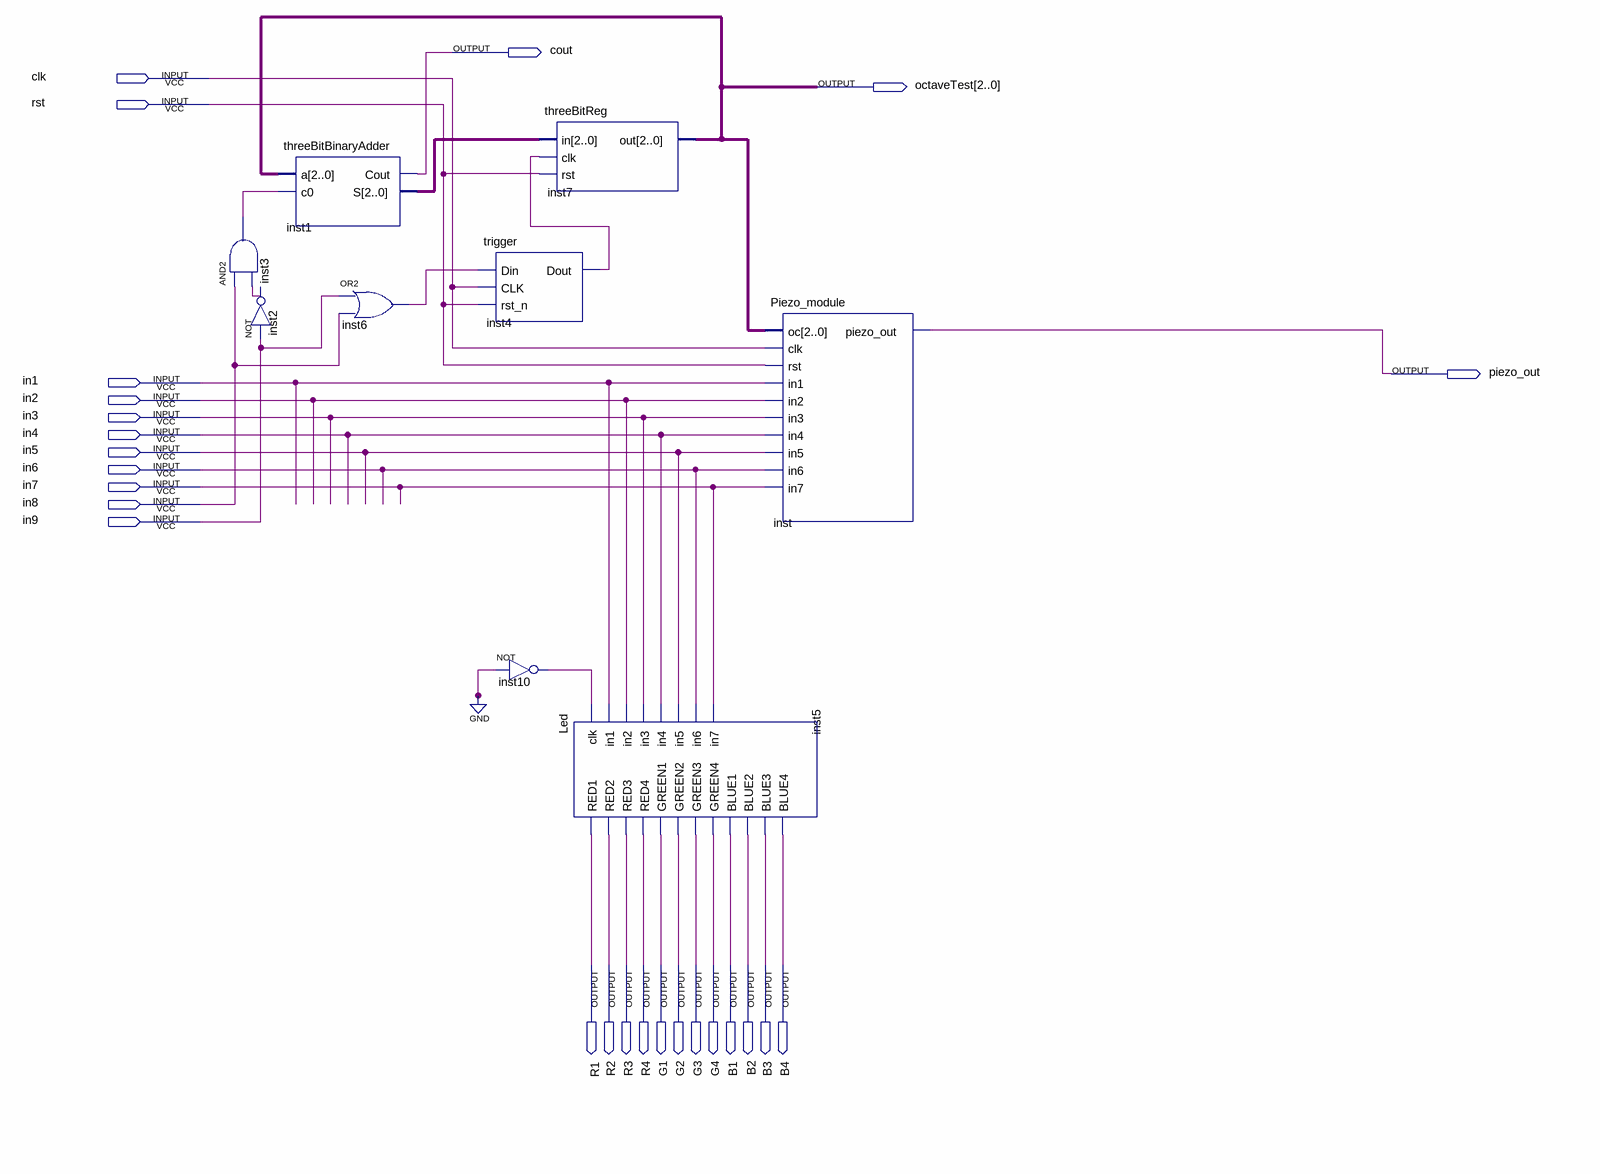
[diagram p0: schematic sheet]
// Quartus schematic main.bdf as structural Verilog: 9 symbols, 26 pins
module main (
  input  clk,
  input  rst,
  input  in1,
  input  in2,
  input  in3,
  input  in4,
  input  in5,
  input  in6,
  input  in7,
  input  in8,
  input  in9,
  output cout,
  output [2:0] octaveTest,
  output piezo_out,
  output R1,
  output R2,
  output R3,
  output R4,
  output G1,
  output G2,
  output G3,
  output G4,
  output B1,
  output B2,
  output B3,
  output B4
);

  wire inst2_out, inst3_out, inst4_dout, inst6_out, inst10_out;
  wire [2:0] inst1_s;

  and inst3 (inst3_out, in8, inst2_out);
  threeBitBinaryAdder inst1 (.a(octaveTest), .c0(inst3_out), .Cout(cout), .S(inst1_s));
  not inst2 (inst2_out, in9);
  or inst6 (inst6_out, in9, in8);
  trigger inst4 (.Din(inst6_out), .CLK(clk), .rst_n(rst), .Dout(inst4_dout));
  not inst10 (inst10_out, 1'b0);
  threeBitReg inst7 (.in(inst1_s), .clk(inst4_dout), .rst(rst), .out(octaveTest));
  Led inst5 (
    .clk(inst10_out), .in1(in1), .in2(in2), .in3(in3), .in4(in4), .in5(in5), .in6(in6), .in7(in7), .RED1(R1),
    .RED2(R2), .RED3(R3), .RED4(R4), .GREEN1(G1), .GREEN2(G2), .GREEN3(G3), .GREEN4(G4), .BLUE1(B1),
    .BLUE2(B2), .BLUE3(B3), .BLUE4(B4));
  Piezo_module inst (
    .oc(octaveTest), .clk(clk), .rst(rst), .in1(in1), .in2(in2), .in3(in3), .in4(in4), .in5(in5), .in6(in6),
    .in7(in7), .piezo_out(piezo_out));
endmodule
